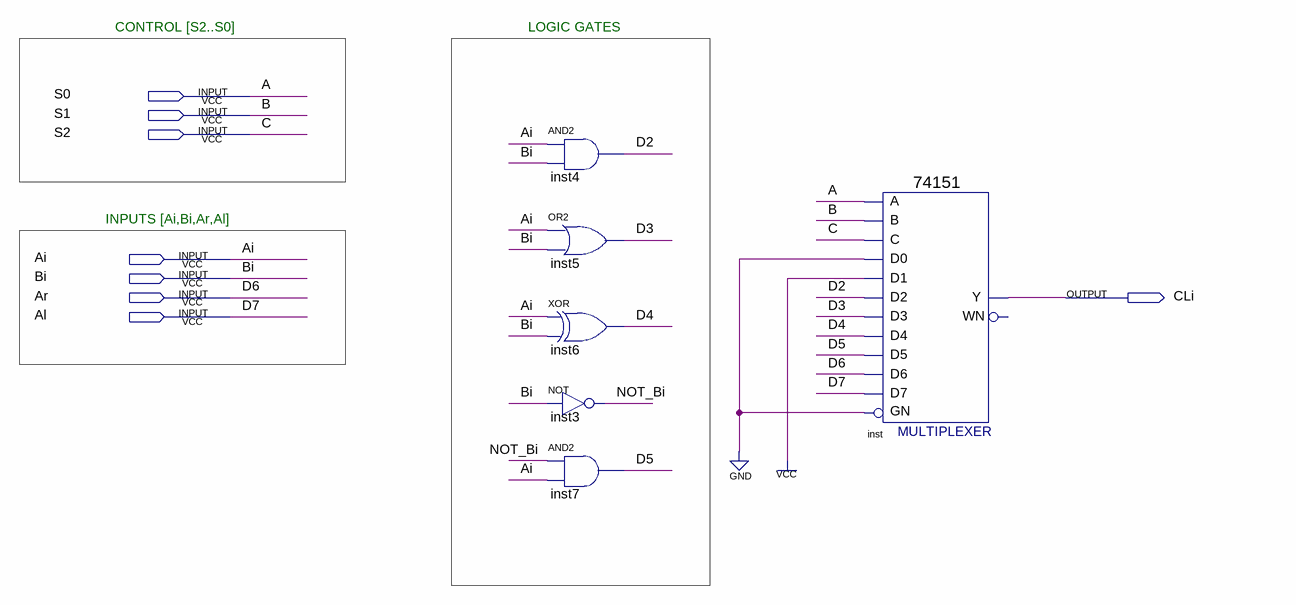
[diagram p0: schematic sheet]
// Quartus schematic LSC1bit.bdf as structural Verilog: 6 symbols, 8 pins
module LSC1bit (
  input  S0,
  input  S1,
  input  S2,
  input  Ai,
  input  Bi,
  input  Ar,
  input  Al,
  output CLi
);

  wire D2, D3, D4, D5, NOT_Bi;

  and inst4 (D2, Ai, Bi);
  or inst5 (D3, Ai, Bi);
  xor inst6 (D4, Ai, Bi);
  not inst3 (NOT_Bi, Bi);
  and inst7 (D5, NOT_Bi, Ai);
  \74151  inst (
    .GN(1'b0), .C(S2), .B(S1), .A(S0), .D5(D5), .D0(1'b0), .D1(1'b1), .D4(D4), .D3(D3), .D2(D2), .D6(Ar),
    .D7(Al), .Y(CLi));  // open: WN

  // Other names for the same wires on the sheet: A = S0; B = S1; C = S2; D6 = Ar; D7 = Al

  // Notes on the sheet:
  //   CONTROL [S2..S0]
  //   LOGIC GATES
  //   INPUTS [Ai,Bi,Ar,Al]
endmodule
